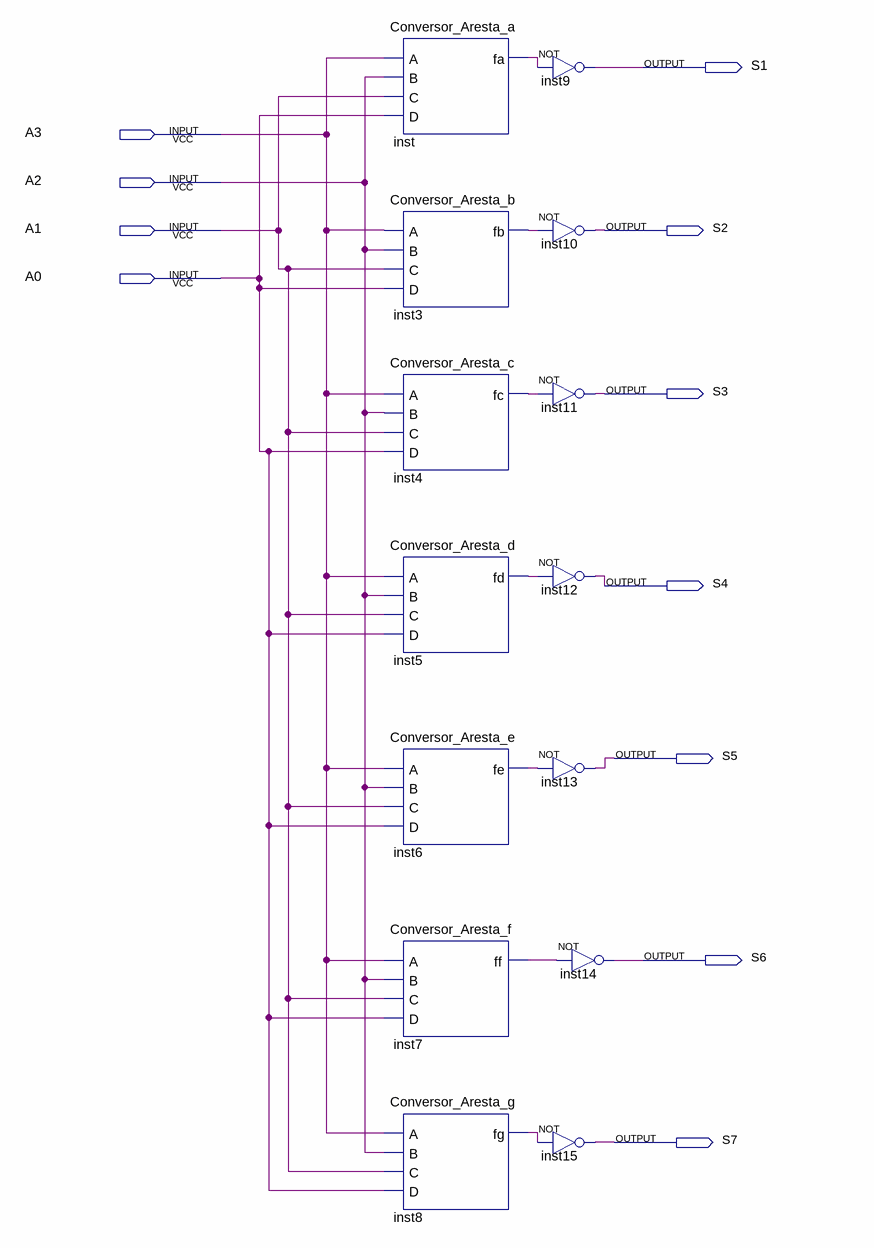
[diagram p0: schematic sheet]
// Quartus schematic Display7SEG.bdf as structural Verilog: 14 symbols, 11 pins
module Display7SEG (
  input  A3,
  input  A2,
  input  A1,
  input  A0,
  output S1,
  output S2,
  output S3,
  output S4,
  output S5,
  output S6,
  output S7
);

  wire inst3_fb, inst4_fc, inst5_fd, inst6_fe, inst7_ff, inst8_fg, inst_fa;

  Conversor_Aresta_a inst (.A(A3), .B(A2), .C(A1), .D(A0), .fa(inst_fa));
  Conversor_Aresta_b inst3 (.A(A3), .B(A2), .C(A1), .D(A0), .fb(inst3_fb));
  Conversor_Aresta_c inst4 (.A(A3), .B(A2), .C(A1), .D(A0), .fc(inst4_fc));
  Conversor_Aresta_d inst5 (.A(A3), .B(A2), .C(A1), .D(A0), .fd(inst5_fd));
  Conversor_Aresta_e inst6 (.A(A3), .B(A2), .C(A1), .D(A0), .fe(inst6_fe));
  Conversor_Aresta_f inst7 (.A(A3), .B(A2), .C(A1), .D(A0), .ff(inst7_ff));
  Conversor_Aresta_g inst8 (.A(A3), .B(A2), .C(A1), .D(A0), .fg(inst8_fg));
  not inst9 (S1, inst_fa);
  not inst10 (S2, inst3_fb);
  not inst11 (S3, inst4_fc);
  not inst12 (S4, inst5_fd);
  not inst13 (S5, inst6_fe);
  not inst15 (S7, inst8_fg);
  not inst14 (S6, inst7_ff);
endmodule
